# EasyEDA Pro project easy_eda_proj.eprj, board PCB5
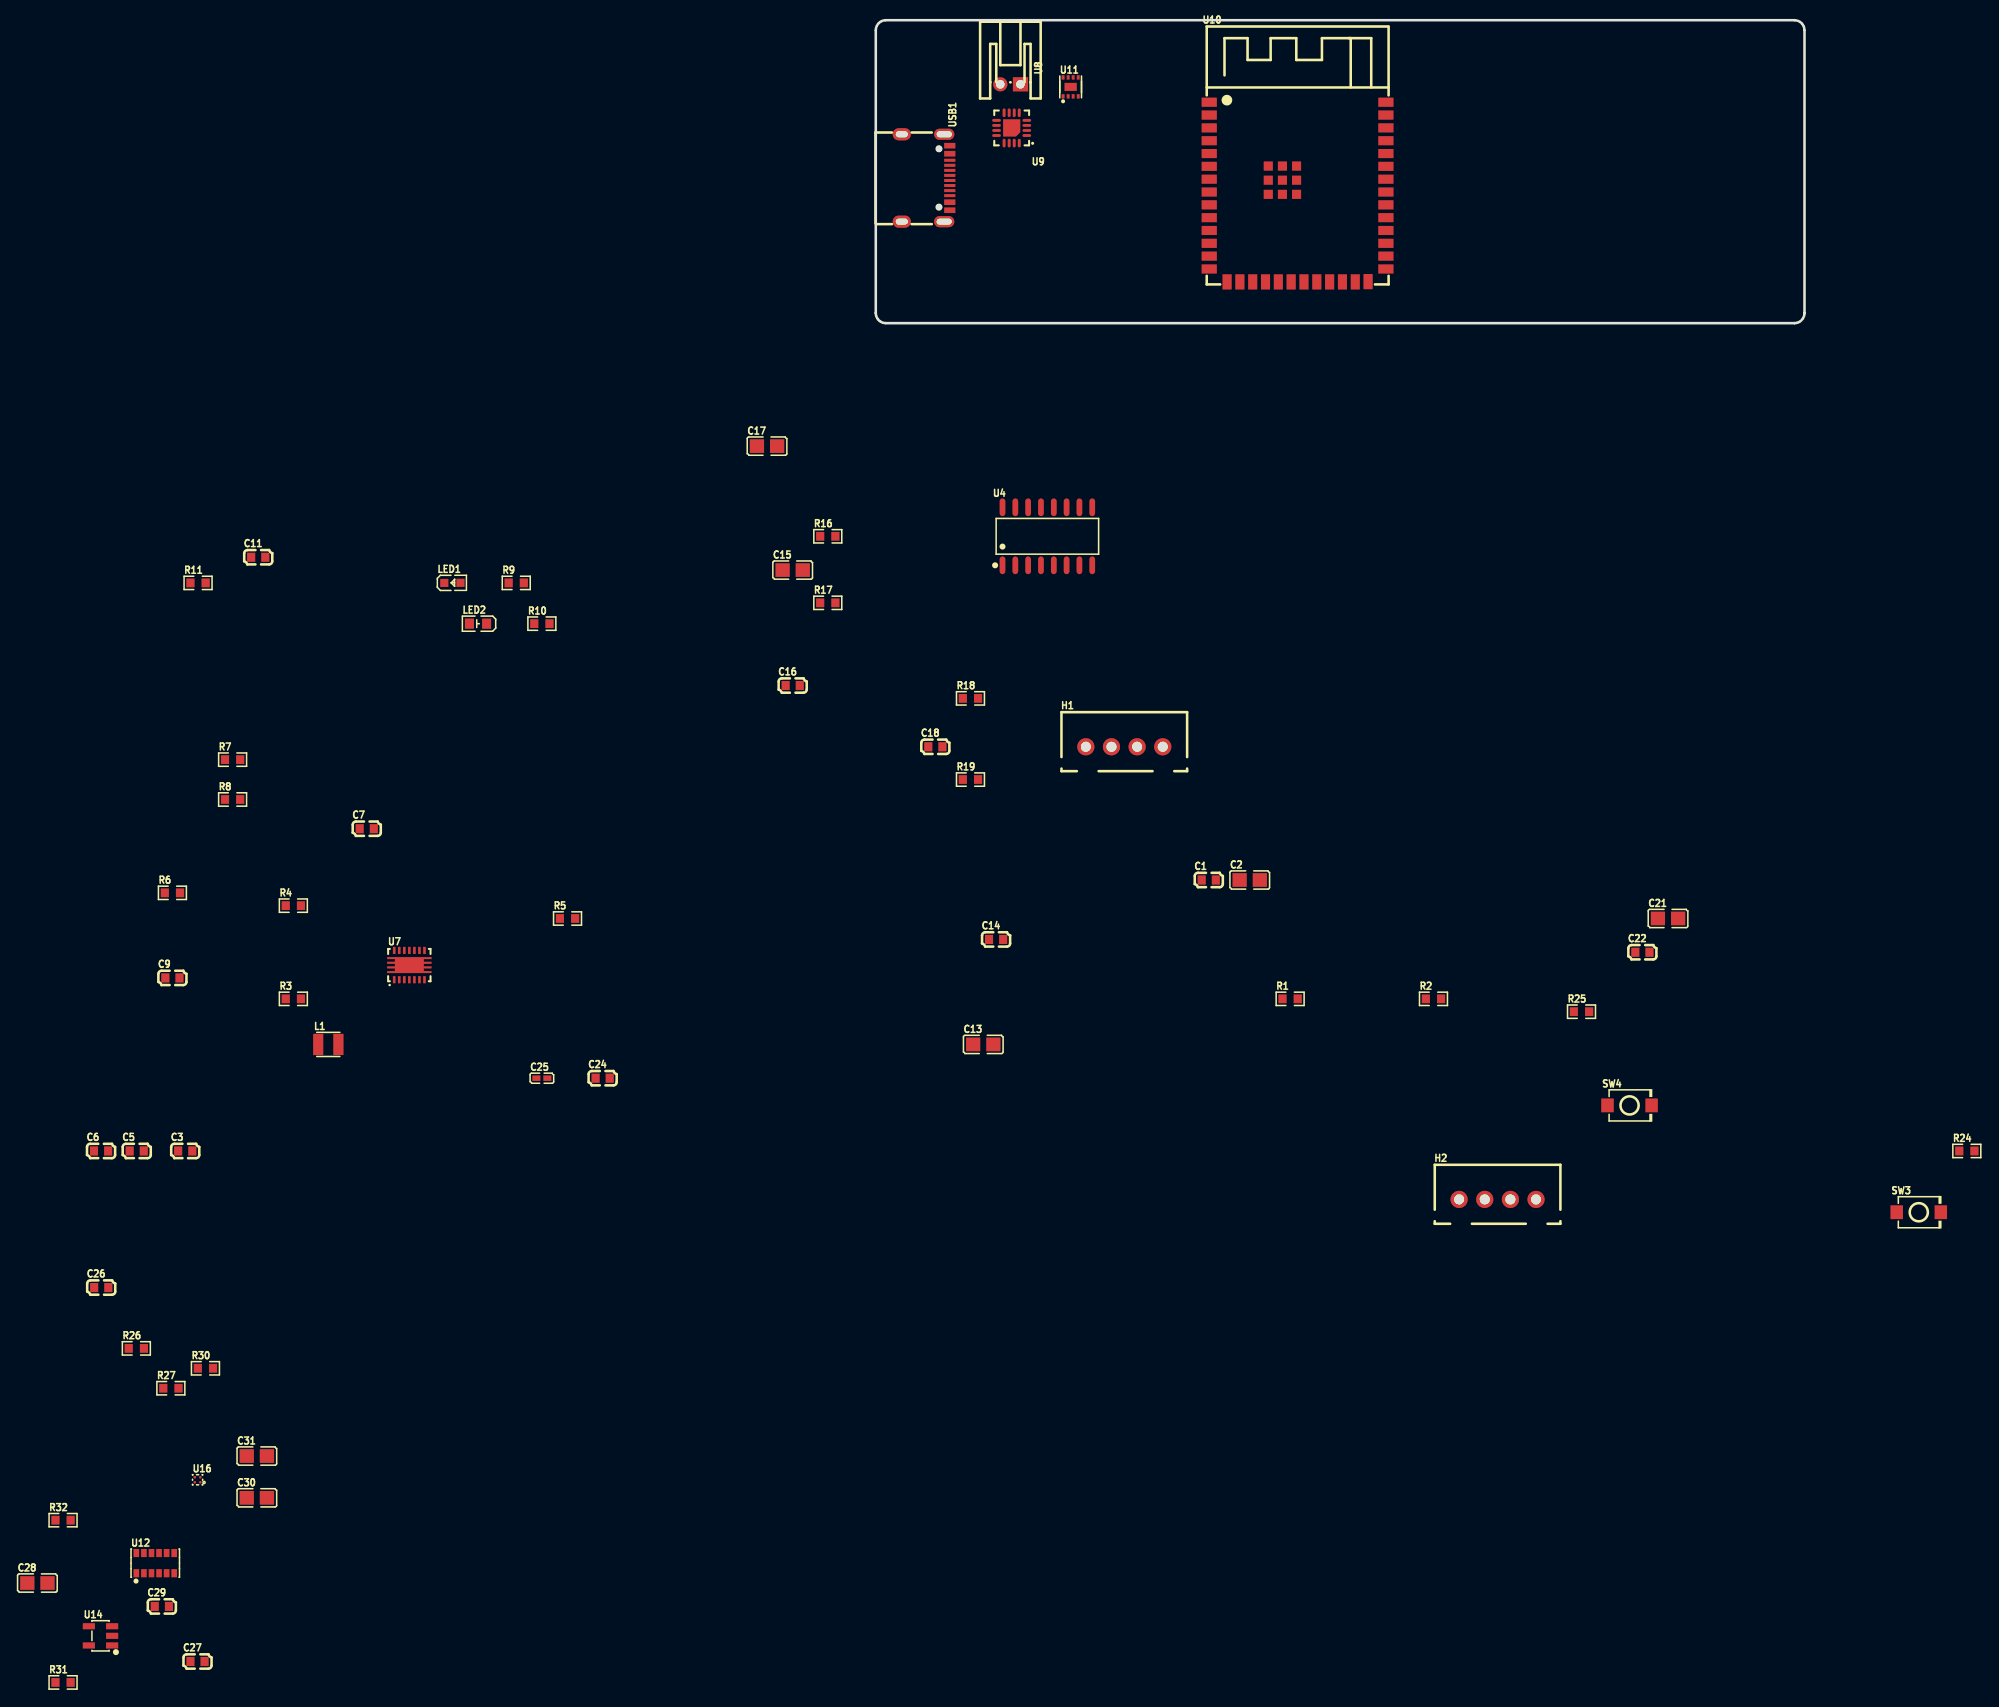
[diagram p5: board, top side]
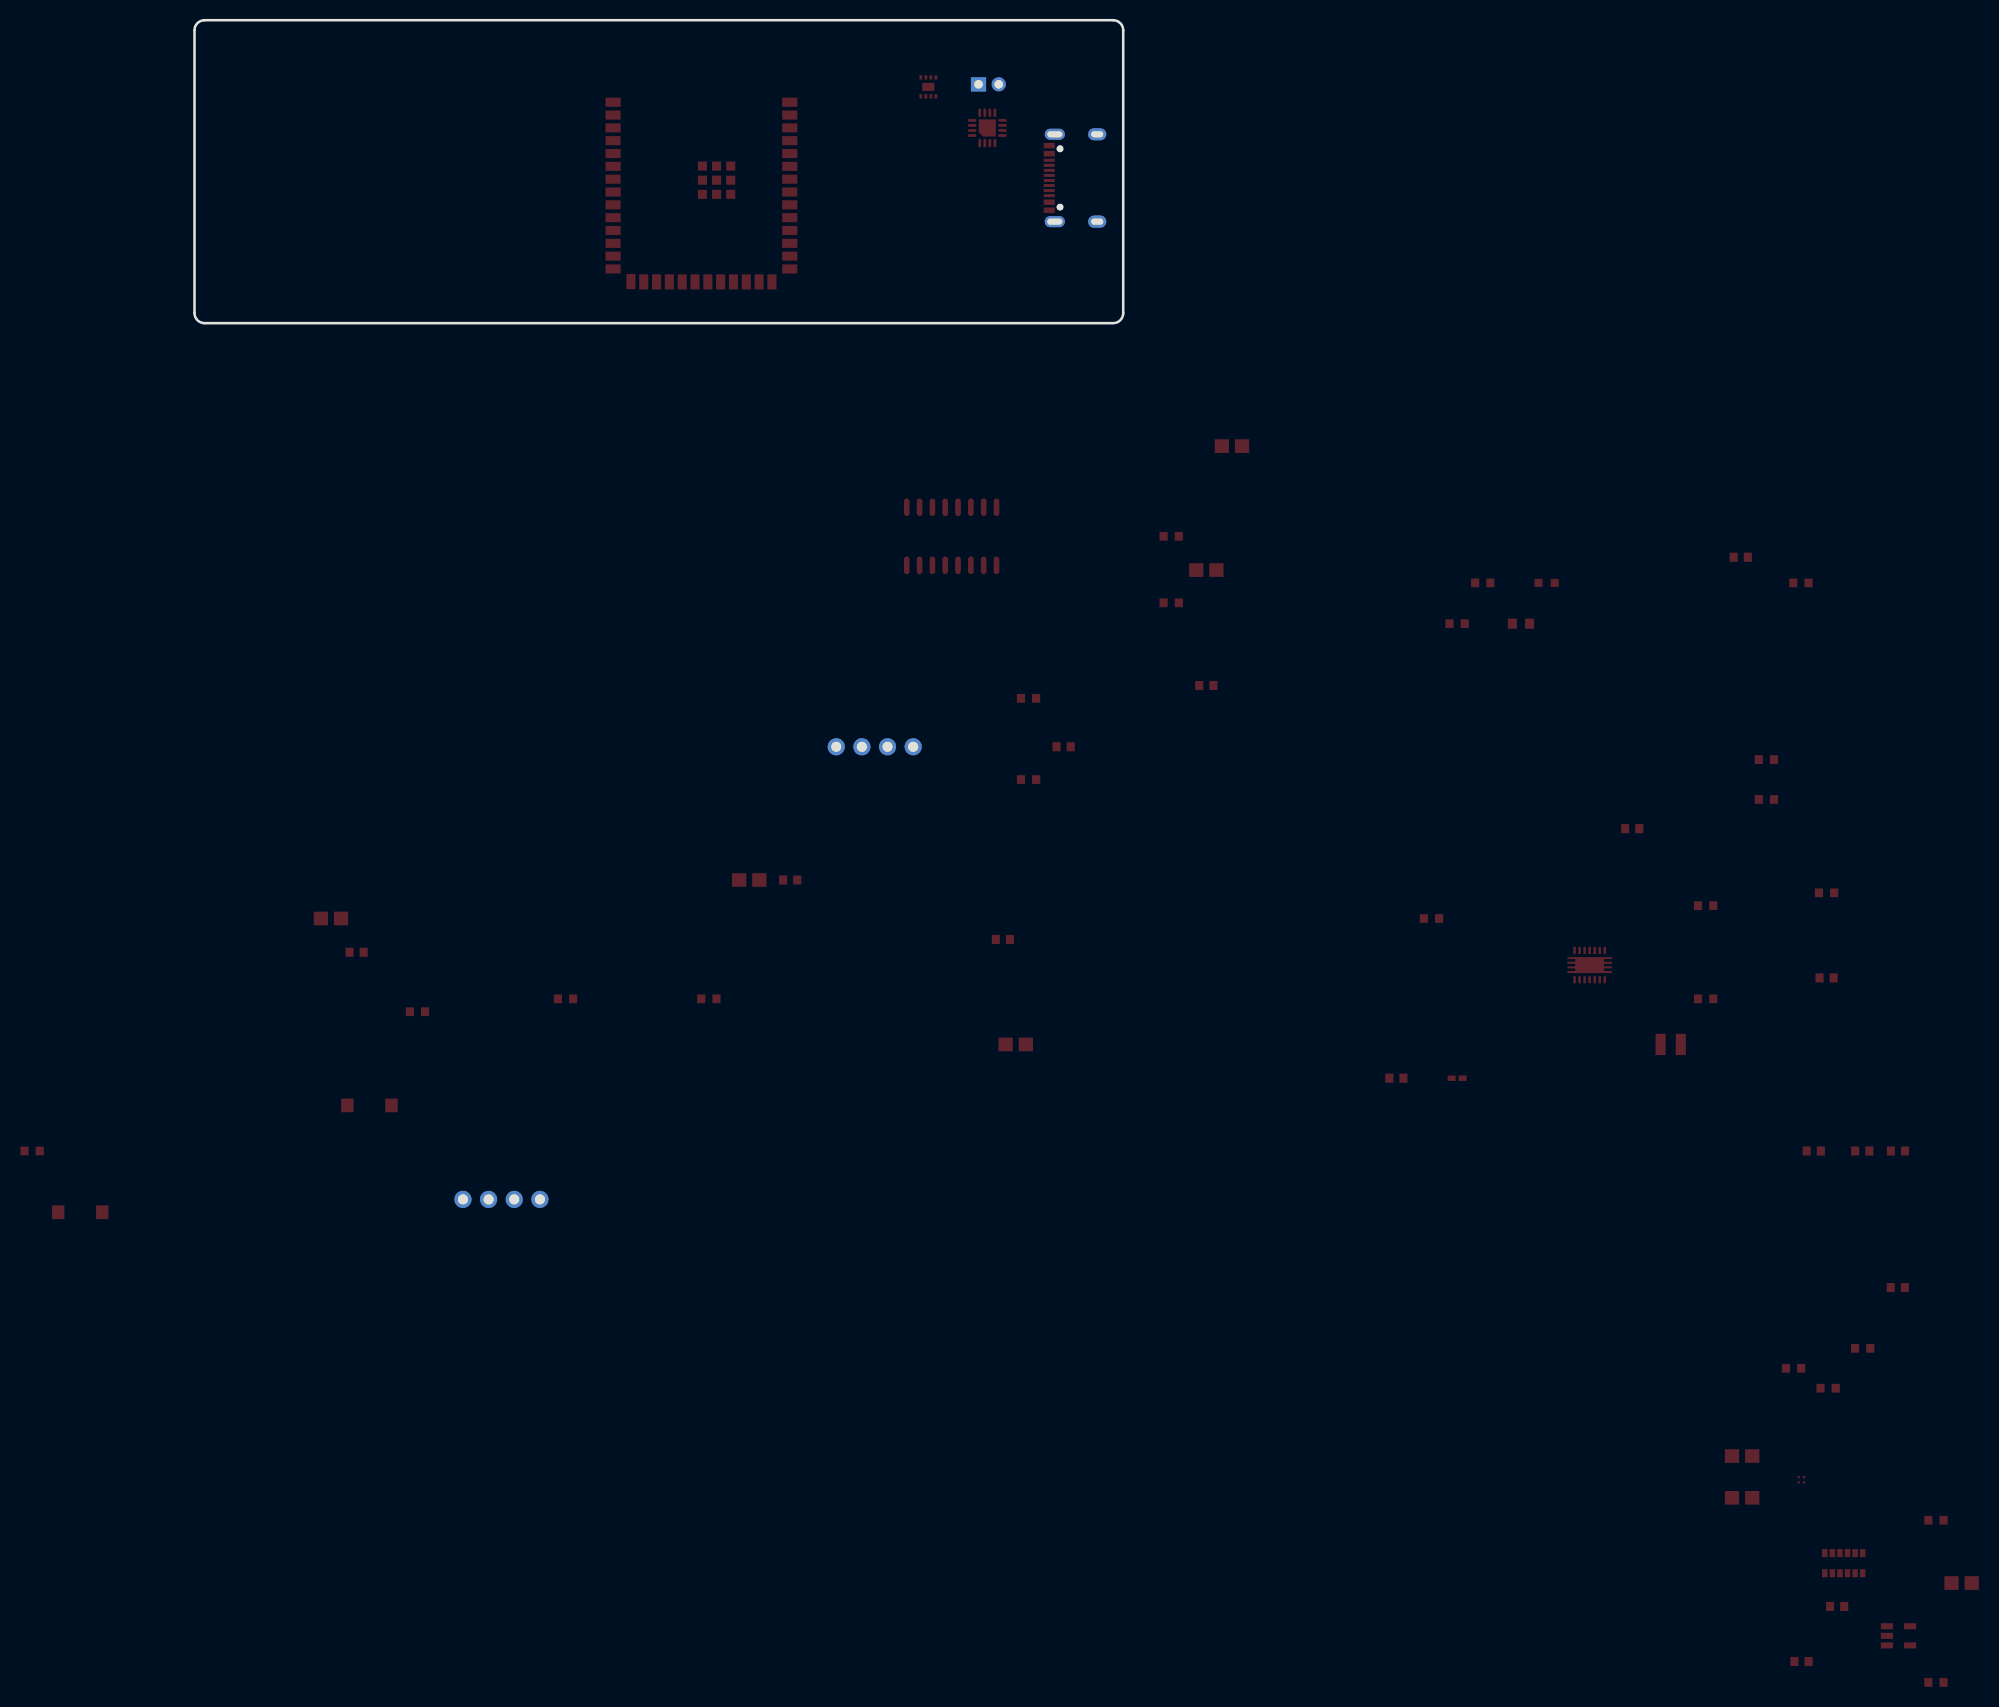
[diagram p6: board, bottom side, seen from below]

Outline 92 x 30 mm; copper layers: Top Layer, Bottom Layer. Coordinates in mm from the lower left corner of the outline.
Outline path: 0,29 0,1 arc(0.29,0.29) 1,0 91,0 arc(91.71,0.29) 92,1 92,29 arc(91.71,29.71) 91,30 1,30 arc(0.29,29.71) 0,29
Stack: Top Layer 0.035mm / Dielectric1 1.51mm FR4 er 4.5 / Bottom Layer 0.035mm

## Design rules (mm)
template: JLCPCB Capability(Two Layers Board)
spacing copperThickness1oz (default): track to track 0.102, other pairs 0.152 to 0.3
spacing copperThickness2oz: track to track 0.203, other pairs 0.152 to 0.3
track width copperThickness1oz (default): min 0.127, default 0.254, max 2.54
track width copperThickness2oz: min 0.203, default 0.254, max 2.54
differential pair differentialPair (default): width min 0.127, default 0.254, max 2.54; gap min 0.152, default 0.152
via viaSize (default): diameter min 0.5, default 0.61, max 10; hole min 0.3, default 0.305, max 6.3

## Placement (name value [footprint] x y rotation side)
C1  100nF  [C0603]  32.99 -55.14 0 top
C2  10uF  [C0805]  37.04 -55.14 0 top
C3  22uF  [C0603]  -68.41 -81.97 0 top
C5  22uF  [C0603]  -73.21 -81.97 0 top
C6  22uF  [C0603]  -76.74 -81.97 0 top
C7  100nF  [C0603]  -50.42 -50.06 0 top
C9  4.7pF  [C0603]  -69.68 -64.83 0 top
C11  1uF  [C0603]  -61.17 -23.18 0 top
C13  4.7uF  [C0805]  10.65 -71.42 0 top
C14  100nF  [C0603]  11.92 -61.02 0 top
C15  10uF  [C0805]  -8.23 -24.45 0 top
C16  100nF  [C0603]  -8.23 -35.88 0 top
C17  10uF  [C0805]  -10.77 -12.17 0 top
C18  100nF  [C0603]  5.9 -41.95 0 top
C21  10uF  [C0805]  78.48 -58.95 0 top
C22  100nF  [C0603]  75.94 -62.29 0 top
C24  22uF  [C0603]  -27.06 -74.76 0 top
C25  100nF  [C0402]  -33.08 -74.76 0 top
C26  100nF  [C0603]  -76.73 -95.49 0 top
C27  10nF  [C0603]  -67.19 -132.52 0 top
C28  1uF  [C0805]  -83.05 -124.75 0 top
C29  2.2uF  [C0603]  -70.72 -127.07 0 top
C30  1uF  [C0805]  -61.31 -116.31 0 top
C31  1uF  [C0805]  -61.31 -112.18 0 top
H1  -  [CONN-TH_B4B-XH-A-LF-SN]  24.62 -41.95 0 top
H2  -  [CONN-TH_B4B-XH-A-LF-SN]  61.6 -86.77 0 top
L1  1.5uH  [IND-SMD_L2.5-W2.0_MEKK2520TR47M]  -54.23 -71.42 0 top
LED1  XL-1608SURC-06  [LED0603-RD_RED]  -41.94 -25.72 0 top
LED2  YLED0603B  [LED0603-FD]  -39.4 -29.75 0 top
R1  5.1kΩ  [R0603]  41.05 -66.91 0 top
R2  5.1kΩ  [R0603]  55.25 -66.91 0 top
R3  180kΩ  [R0603]  -57.7 -66.91 0 top
R4  1MΩ  [R0603]  -57.7 -57.68 0 top
R5  1MΩ  [R0603]  -30.54 -58.95 0 top
R6  68kΩ  [R0603]  -69.68 -56.41 0 top
R7  1.18kΩ  [R0603]  -63.71 -43.22 0 top
R8  1.13kΩ  [R0603]  -63.71 -47.16 0 top
R9  1kΩ  [R0603]  -35.62 -25.72 0 top
R10  1kΩ  [R0603]  -33.08 -29.75 0 top
R11  10kΩ  [R0603]  -67.14 -25.72 0 top
R16  20kΩ  [R0603]  -4.75 -21.1 0 top
R17  8.2kΩ  [R0603]  -4.75 -27.69 0 top
R18  100Ω  [R0603]  9.38 -37.15 0 top
R19  100Ω  [R0603]  9.38 -45.19 0 top
R24  10kΩ  [R0603]  108.08 -81.97 0 top
R25  10kΩ  [R0603]  69.91 -68.18 0 top
R26  10kΩ  [R0603]  -73.25 -101.51 0 top
R27  10kΩ  [R0603]  -69.83 -105.46 0 top
R30  10kΩ  [R0603]  -66.4 -103.49 0 top
R31  10kΩ  [R0603]  -80.51 -134.59 0 top
R32  47kΩ  [R0603]  -80.51 -118.53 0 top
SW3  TS-1088-AR02016  [SW-SMD_L3.9-W3.0-P4.45]  103.32 -88.04 0 top
SW4  TS-1088-AR02016  [SW-SMD_L3.9-W3.0-P4.45]  74.67 -77.46 0 top
U4  HX711  [SOP-16_L10.0-W3.9-P1.27-LS6.0-BL]  17 -21.1 0 top
U7  TPS63020DSJT  [VSON-14_L4.0-W3.0-P0.50-BL-EP_TI_DSJ]  -46.21 -63.56 0 top
U8  S2B-PH-K-S(LF)(SN)  [CONN-TH_S2B-PH-K-S-LF-SN]  13.33 23.65 0 top
U9  BQ24075RGTR  [QFN-16_L3.0-W3.0-P0.50-TL-EP1.7]  13.46 19.33 180 top
U10  2.4GHz  [WIRELM-SMD_ESP32-S3-WROOM-1]  41.78 12.98 0 top
U11  MAX17048G+T10  [TDFN-8_L2.0-W2.0-P0.50-BL-EP1.2]  19.3 23.4 0 top
U12  VL6180XV0NR/1  [LGA-12_L4.8-W2.8-P0.75-BL]  -71.37 -122.78 0 top
U14  LP2985IM5-2.8  [SOT-23-5_L3.0-W1.6-P0.95-LS2.8-BR]  -76.8 -129.98 0 top
U16  AP22908CN4-7  [X1-WLB0909-4_L0.9-W0.9-R2-C2-P0.55-BR]  -67.18 -114.53 0 top
USB1  TYPE-C 16PIN 2MD(073)  [USB-C-SMD_TYPE-C-6PIN-2MD-073]  4.95 14.38 270 top

## Footprints (pads in the part's own frame, mm; a bottom-side part is the same pattern mirrored in y, then rotated)
C0402
  rect 0.79x0.54 smd: 1(-0.545,0) 2(0.545,0)
C0603
  rect 0.8x0.9 smd: 1(-0.7,0) 2(0.7,0)
C0805
  rect 1.41x1.35 smd: 1(-1,0) 2(1,0)
CONN-TH_B4B-XH-A-LF-SN
  round 1.7 hole 1: 1(-3.81,0) 2(-1.27,0) 3(1.27,0) 4(3.81,0)
CONN-TH_S2B-PH-K-S-LF-SN
  rect 1.5x1.4 hole 0.85: 1(1,0)
  round 1.4 hole 0.85: 2(-1,0)
IND-SMD_L2.5-W2.0_MEKK2520TR47M
  rect 1x2.1 smd: 1(1,0) 2(-1,0)
LED0603-FD
  rect 0.9x1 smd: 1(-0.85,0) 2(0.85,0)
LED0603-RD_RED
  rect 0.8x0.8 smd: 1(-0.799,-0.004) 2(0.799,0.004)
LGA-12_L4.8-W2.8-P0.75-BL
  rect 0.55x0.8 smd: 1(-1.875,-1) 2(-1.125,-1) 3(-0.375,-1) 4(0.375,-1) 5(1.125,-1) 6(1.875,-1) 7(1.875,1) 8(1.125,1) 9(0.375,1) 10(-0.375,1) 11(-1.125,1) 12(-1.875,1)
QFN-16_L3.0-W3.0-P0.50-TL-EP1.7
  oval 0.85x0.28 smd: 1(-1.5,0.75) 2(-1.5,0.25) 3(-1.5,-0.25) 4(-1.5,-0.75) 9(1.5,-0.75) 10(1.5,-0.25) 11(1.5,0.25) 12(1.5,0.75)
  oval 0.28x0.85 smd: 5(-0.75,-1.5) 6(-0.25,-1.5) 7(0.25,-1.5) 8(0.75,-1.5) 13(0.75,1.5) 14(0.25,1.5) 15(-0.25,1.5) 16(-0.75,1.5)
  custom 1.7x1.7 smd: 17(0,0)
R0603
  rect 0.806x0.864 smd: 1(-0.753,0) 2(0.753,0)
SOP-16_L10.0-W3.9-P1.27-LS6.0-BL
  oval 0.56x1.745 smd: 1(-4.445,-2.873) 2(-3.175,-2.873) 3(-1.905,-2.873) 4(-0.635,-2.873) 5(0.635,-2.873) 6(1.905,-2.873) 7(3.175,-2.873) 8(4.445,-2.873) 9(4.445,2.873) 10(3.175,2.873) 11(1.905,2.873) 12(0.635,2.873) 13(-0.635,2.873) 14(-1.905,2.873) 15(-3.175,2.873) 16(-4.445,2.873)
SOT-23-5_L3.0-W1.6-P0.95-LS2.8-BR
  rect 1.2x0.6 smd: 1(1.15,-0.95) 2(1.15,0) 3(1.15,0.95) 4(-1.15,0.95) 5(-1.15,-0.95)
SW-SMD_L3.9-W3.0-P4.45
  rect 1.23x1.36 smd: 1(-2.185,0) 2(2.185,0)
TDFN-8_L2.0-W2.0-P0.50-BL-EP1.2
  rect 0.28x0.425 smd: 1(-0.75,-0.938) 2(-0.25,-0.938) 3(0.25,-0.938) 4(0.75,-0.938) 5(0.75,0.938) 6(0.25,0.938) 7(-0.25,0.938) 8(-0.75,0.938)
  rect 1.2x0.8 smd: 9(0,0)
USB-C-SMD_TYPE-C-6PIN-2MD-073
  rect 0.55x1.1 smd: 1(-3.2,2.375) 2(-2.4,2.375) 11(2.4,2.375) 12(3.2,2.375)
  rect 0.3x1.1 smd: 3(-1.75,2.375) 4(-1.25,2.375) 5(-0.75,2.375) 6(-0.25,2.375) 7(0.25,2.375) 8(0.75,2.375) 9(1.25,2.375) 10(1.75,2.375)
  oval 1.1x2 hole 0.6x1.5: 13(-4.325,1.825) 14(4.325,1.825)
  oval 1.2x1.8 hole 0.6x1.2: 13(-4.325,-2.375) 14(4.325,-2.375)
VSON-14_L4.0-W3.0-P0.50-BL-EP_TI_DSJ
  rect 0.25x0.7 smd: 1(-1.5,-1.45) 2(-1,-1.45) 3(-0.5,-1.45) 4(0,-1.45) 5(0.5,-1.45) 6(1,-1.45) 7(1.5,-1.45) 8(1.5,1.45) 9(1,1.45) 10(0.5,1.45) 11(0,1.45) 12(-0.5,1.45) 13(-1,1.45) 14(-1.5,1.45)
  custom 4.4x1.58 smd: 15(0,0)
WIRELM-SMD_ESP32-S3-WROOM-1
  rect 1.5x0.9 smd: 1(-8.75,8.895) 2(-8.75,7.625) 3(-8.75,6.355) 4(-8.75,5.085) 5(-8.75,3.815) 6(-8.75,2.545) 7(-8.75,1.275) 8(-8.75,0.005) 9(-8.75,-1.265) 10(-8.75,-2.535) 11(-8.75,-3.805) 12(-8.75,-5.075) 13(-8.75,-6.345) 14(-8.75,-7.615) 27(8.75,-7.615) 28(8.75,-6.345) 29(8.75,-5.075) 30(8.75,-3.805) 31(8.75,-2.535) 32(8.75,-1.265) 33(8.75,0.005) 34(8.75,1.275) 35(8.75,2.545) 36(8.75,3.815) 37(8.75,5.085) 38(8.75,6.355) 39(8.75,7.625) 40(8.75,8.895)
  rect 0.9x1.5 smd: 15(-6.985,-8.895) 16(-5.715,-8.895) 17(-4.445,-8.895) 18(-3.175,-8.895) 19(-1.905,-8.895) 20(-0.635,-8.895) 21(0.635,-8.895) 22(1.905,-8.895) 23(3.175,-8.895) 24(4.445,-8.895) 25(5.715,-8.895) 26(6.985,-8.865)
  rect 0.9x0.9 smd: 41(-2.9,2.575) 41(-2.9,1.175) 41(-2.9,-0.225) 41(-1.5,2.575) 41(-1.5,1.175) 41(-1.5,-0.225) 41(-0.1,2.575) 41(-0.1,1.175) 41(-0.1,-0.225)
X1-WLB0909-4_L0.9-W0.9-R2-C2-P0.55-BR
  round 0.25 smd: A1(0.275,-0.25) A2(-0.275,-0.25) B1(0.275,0.25) B2(-0.275,0.25)

## Nets
2.8V: C29.1 R26.1 R27.1 R30.1 R32.1 U11.3 U14.5
3.3V: C3.2 C5.2 C6.2 C21.1 C22.1 C28.1 C30.2 H2.4 R4.2 R5.2 R6.2 R24.2 R25.1 R31.1 U7.4 U7.5 U10.2 U14.1 U16.A2
3.3V_HX711: C17.1 C31.1 U4.1 U4.16 U16.A1
GND: C1.1 C2.1 C3.1 C5.1 C6.1 C7.2 C11.1 C13.1 C14.1 C15.1 C16.2 C17.2 C21.2 C22.2 C24.1 C25.1 C26.1 C27.2 C28.2 C29.2 C30.1 C31.2 H1.2 H2.1 R1.1 R2.1 R3.1 R7.1 R8.1 R11.1 R17.1 SW3.1 SW4.1 U4.2 U4.5 U4.9 U4.10 U4.14 U4.15 U7.2 U7.15 U8.2 U9.4 U9.6 U9.8 U9.14 U9.15 U10.1 U10.40 U10.41 U11.1 U11.4 U11.6 U11.9 U12.9 U12.12 U14.2 U16.B1 USB1.1 USB1.12 USB1.13 USB1.14
VBUS: C1.2 C2.2 C11.2 U9.13 USB1.2 USB1.11
11: H2.2 U10.19
14: H2.3 U10.22
32: U4.11 U10.20
34: U4.12 U10.18
ALERT: R30.2 U10.23 U11.5
CELL: C26.2 U8.1 U9.2 U9.3 U11.2
D+: U10.14 USB1.6 USB1.8
D-: U10.13 USB1.5 USB1.7
HX711_ON: U10.11 U16.B2
PS: U7.13 U10.9
SCL: R27.2 U10.17 U11.7 U12.5
SDA: R26.2 U10.12 U11.8 U12.6
TOF_ON: R31.2 U10.21 U14.3
VOUT: C24.2 C25.2 R9.2 R10.2 U7.10 U7.11 U9.5 U9.10 U9.11
$1N1499: R1.2 USB1.4
$1N1538: R2.2 USB1.10
$1N2804: L1.1 U7.8 U7.9
$1N2809: L1.2 U7.6 U7.7
$1N2919: R5.1 U7.14
$1N3098: C7.1 U7.1 U7.12
$1N3230: C9.1 R3.2 R4.1 U7.3
$1N3482: C9.2 R6.1
$1N4163: R7.2 U9.12
$1N4202: R8.2 U9.16
$1N4584: LED1.1 U9.9
$1N4586: LED1.2 R9.1
$1N4675: LED2.2 U9.7
$1N4721: LED2.1 R10.1
$1N4792: R11.2 U9.1
$1N5724: R16.1 R17.2 U4.4
$1N5746: C15.2 H1.1 R16.2 U4.3
$1N5829: C16.1 U4.6
$1N6086: C18.2 R18.1 U4.8
$1N6088: C18.1 R19.1 U4.7
$1N6257: H1.4 R18.2
$1N6263: H1.3 R19.2
$1N25078: R24.1 SW3.2 U10.27
$1N25329: R25.2 SW4.2 U10.3
$1N40837: C27.1 U14.4
$1N41276: R32.2 U12.4
$1N41322: C13.2 C14.2 U12.8 U12.10

Pads without a net: U4 13; U9 17; U10 4 5 6 7 8 10 15 16 24 25 26 28 29 30 31 32 33 34 35 36 37 38 39; U12 1 2 3 7 11; USB1 3 9
